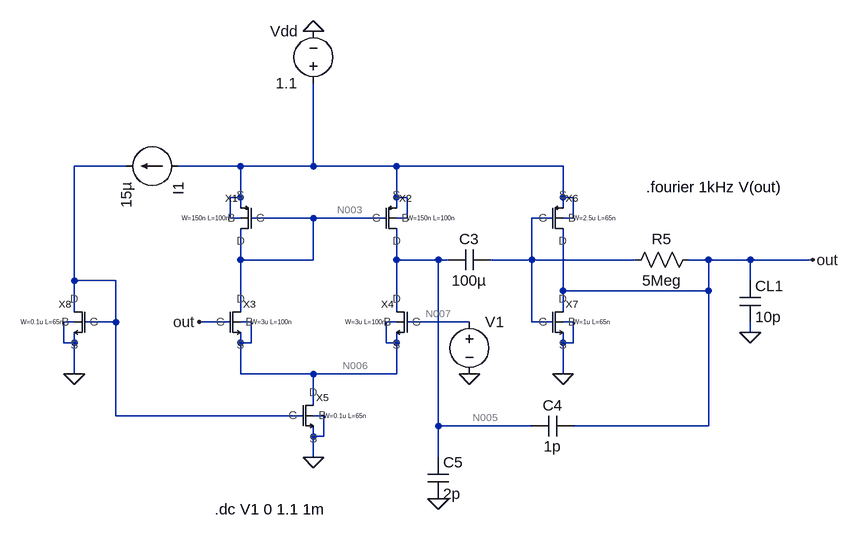
[diagram p0: schematic q2.asc]
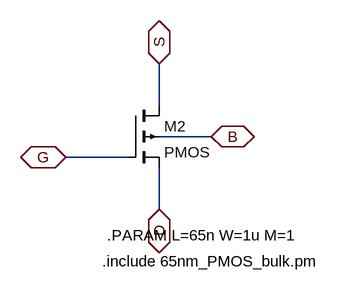
[diagram p1: sub-circuit pmos65.asc]
q2.asc, the LTspice schematic file:
Version 4
SHEET 1 1400 680
WIRE 288 48 208 48
WIRE 464 48 368 48
WIRE 576 48 576 -80
WIRE 576 48 464 48
WIRE 704 48 576 48
WIRE 960 48 704 48
WIRE 464 96 464 48
WIRE 464 96 448 96
WIRE 704 96 704 48
WIRE 720 96 704 96
WIRE 960 96 960 48
WIRE 976 96 960 96
WIRE 464 112 464 96
WIRE 704 112 704 96
WIRE 960 112 960 96
WIRE 448 128 448 96
WIRE 464 128 448 128
WIRE 576 128 480 128
WIRE 688 128 576 128
WIRE 720 128 720 96
WIRE 720 128 704 128
WIRE 944 128 912 128
WIRE 976 128 976 96
WIRE 976 128 960 128
WIRE 464 192 464 144
WIRE 576 192 576 128
WIRE 576 192 464 192
WIRE 704 192 704 144
WIRE 768 192 704 192
WIRE 784 192 768 192
WIRE 912 192 912 128
WIRE 912 192 848 192
WIRE 1072 192 912 192
WIRE 1184 192 1152 192
WIRE 1248 192 1184 192
WIRE 1344 192 1248 192
WIRE 208 224 208 48
WIRE 272 224 208 224
WIRE 1248 224 1248 192
WIRE 960 240 960 144
WIRE 1184 240 1184 192
WIRE 1184 240 960 240
WIRE 208 272 208 224
WIRE 464 272 464 192
WIRE 704 272 704 192
WIRE 960 272 960 240
WIRE 208 288 192 288
WIRE 272 288 272 224
WIRE 272 288 224 288
WIRE 448 288 400 288
WIRE 480 288 464 288
WIRE 704 288 688 288
WIRE 816 288 720 288
WIRE 912 288 912 192
WIRE 944 288 912 288
WIRE 976 288 960 288
WIRE 1248 304 1248 288
WIRE 192 320 192 288
WIRE 208 320 208 304
WIRE 208 320 192 320
WIRE 464 320 464 304
WIRE 480 320 480 288
WIRE 480 320 464 320
WIRE 688 320 688 288
WIRE 704 320 704 304
WIRE 704 320 688 320
WIRE 960 320 960 304
WIRE 976 320 976 288
WIRE 976 320 960 320
WIRE 208 368 208 320
WIRE 464 368 464 320
WIRE 576 368 464 368
WIRE 704 368 704 320
WIRE 704 368 576 368
WIRE 960 368 960 320
WIRE 576 416 576 368
WIRE 272 432 272 288
WIRE 560 432 272 432
WIRE 592 432 576 432
WIRE 768 448 768 192
WIRE 912 448 768 448
WIRE 1184 448 1184 240
WIRE 1184 448 976 448
WIRE 576 464 576 448
WIRE 592 464 592 432
WIRE 592 464 576 464
WIRE 576 496 576 464
WIRE 768 496 768 448
FLAG 576 496 0
FLAG 960 368 0
FLAG 1248 304 0
FLAG 208 368 0
FLAG 1344 192 out
FLAG 768 560 0
FLAG 400 288 out
FLAG 816 368 0
FLAG 576 -160 0
SYMBOL pmos65 448 128 M0
WINDOW 39 0 0 Left 0
SYMATTR SpiceLine W=150n L=100n
SYMATTR InstName X1
SYMBOL pmos65 720 128 R0
WINDOW 39 0 0 Left 0
SYMATTR SpiceLine W=150n L=100n
SYMATTR InstName X2
SYMBOL nmos65 480 288 R0
WINDOW 39 0 0 Left 0
SYMATTR SpiceLine W=3u L=100n
SYMATTR InstName X3
SYMBOL nmos65 688 288 M0
WINDOW 39 0 0 Left 0
SYMATTR SpiceLine W=3u L=100n
SYMATTR InstName X4
SYMBOL nmos65 592 432 R0
WINDOW 39 0 0 Left 0
SYMATTR SpiceLine W=0.1u L=65n
SYMATTR InstName X5
SYMBOL pmos65 976 128 R0
WINDOW 39 0 0 Left 0
SYMATTR SpiceLine W=2.5u L=65n
SYMATTR InstName X6
SYMBOL nmos65 976 288 R0
WINDOW 39 0 0 Left 0
SYMATTR SpiceLine W=1u L=65n
SYMATTR InstName X7
SYMBOL cap 1232 224 R0
SYMATTR InstName CL1
SYMATTR Value 10p
SYMBOL current 368 48 R90
WINDOW 123 0 0 Left 0
WINDOW 39 0 0 Left 0
SYMATTR InstName I1
SYMATTR Value 15µ
SYMBOL nmos65 192 288 M0
WINDOW 39 0 0 Left 0
SYMATTR SpiceLine W=0.1u L=65n
SYMATTR InstName X8
SYMBOL res 1056 208 R270
WINDOW 0 32 56 VTop 2
WINDOW 3 0 56 VBottom 2
SYMATTR InstName R5
SYMATTR Value 5Meg
SYMBOL cap 848 176 R90
WINDOW 0 0 32 VBottom 2
WINDOW 3 32 32 VTop 2
SYMATTR InstName C3
SYMATTR Value 100µ
SYMBOL cap 976 432 R90
WINDOW 0 0 32 VBottom 2
WINDOW 3 32 32 VTop 2
SYMATTR InstName C4
SYMATTR Value 1p
SYMBOL cap 752 496 R0
SYMATTR InstName C5
SYMATTR Value 2p
SYMBOL voltage 816 272 R0
WINDOW 123 0 0 Left 0
WINDOW 39 0 0 Left 0
SYMATTR InstName V1
SYMATTR Value ""
SYMBOL voltage 576 -64 R180
WINDOW 0 24 96 Left 2
WINDOW 3 24 16 Left 2
SYMATTR InstName Vdd
SYMATTR Value 1.1
TEXT 1088 80 Left 2 !.fourier 1kHz V(out)
TEXT 424 576 Left 2 !.dc V1 0 1.1 1m

pmos65.asc, the sub-circuit schematic file:
Version 4
SHEET 1 880 680
WIRE 160 80 160 16
WIRE 240 128 160 128
WIRE 112 160 16 160
WIRE 160 240 160 176
FLAG 16 160 G
IOPIN 16 160 BiDir
FLAG 160 240 D
IOPIN 160 240 BiDir
FLAG 160 16 S
IOPIN 160 16 BiDir
FLAG 240 128 B
IOPIN 240 128 BiDir
SYMBOL pmos4 112 80 R0
SYMATTR InstName M2
SYMATTR Value2 l={L} w={W} ad='2*65n*{W}' as='2*65n*{W}' pd='2*(2*65n+{W})' ps='2*(2*65n+{W})' m={M}
TEXT 80 280 Left 2 !.PARAM L=65n W=1u M=1
TEXT 72 320 Left 2 !.include 65nm_PMOS_bulk.pm

The netlist it stands for:
* q2.asc
XX1 N003 N003 N002 N002 pmos65 params: W=150n L=100n
XX2 N003 N005 N002 N002 pmos65 params: W=150n L=100n
XX3 out N003 N006 N006 nmos65 params: W=3u L=100n  ; pins G D S B
XX4 N007 N005 N006 N006 nmos65 params: W=3u L=100n  ; pins G D S B
XX5 N001 N006 0 0 nmos65 params: W=0.1u L=65n  ; pins G D S B
XX6 N004 out N002 N002 pmos65 params: W=2.5u L=65n
XX7 N004 out 0 0 nmos65 params: W=1u L=65n  ; pins G D S B
CL1 out 0 10p
I1 N002 N001 15µ
XX8 N001 N001 0 0 nmos65 params: W=0.1u L=65n  ; pins G D S B
R5 N004 out 5Meg
C3 N004 N005 100µ
C4 out N005 1p
C5 N005 0 2p
V1 N007 0
Vdd N002 0 1.1

* block symbol definitions
.subckt pmos65 G D S B
M2 S G D B PMOS l={L} w={W} ad='2*65n*{W}' as='2*65n*{W}' pd='2*(2*65n+{W})' ps='2*(2*65n+{W})' m={M}
.PARAM L=65n W=1u M=1
.include 65nm_PMOS_bulk.pm
.ends pmos65

.model NMOS NMOS
.model PMOS PMOS
.lib standard.mos
.fourier 1kHz V(out)
.dc V1 0 1.1 1m
.backanno
.end

* Results of the author's LTspice run, read from the files saved beside the schematic
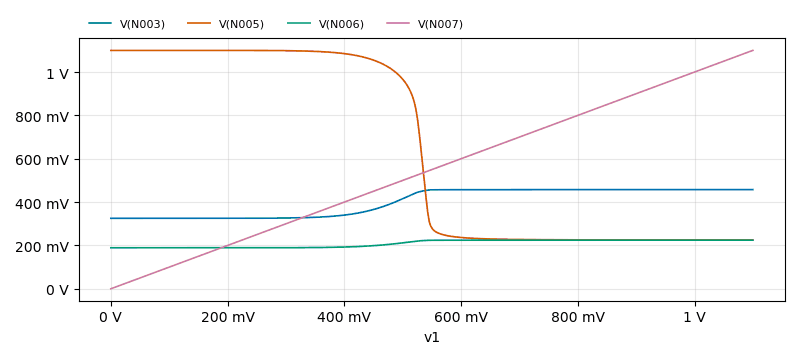
[diagram p2: DC transfer characteristic of q2.asc, plotted from the saved traces]
* DC transfer characteristic, 1 run:
*   V(N003): 325.2 mV at v1=0 V, 457.8 mV at v1=1.1 V, min 325.2 mV, max 457.8 mV
*   V(N005): 1.1 V at v1=0 V, 225.2 mV at v1=1.1 V, min 225.2 mV, max 1.1 V
*   V(N006): 189.2 mV at v1=0 V, 224.4 mV at v1=1.1 V, min 189.2 mV, max 224.4 mV
*   V(N007): 0 V at v1=0 V, 1.1 V at v1=1.1 V, min 0 V, max 1.1 V